# Altium schematic sheet STM32.SchDoc
size A3
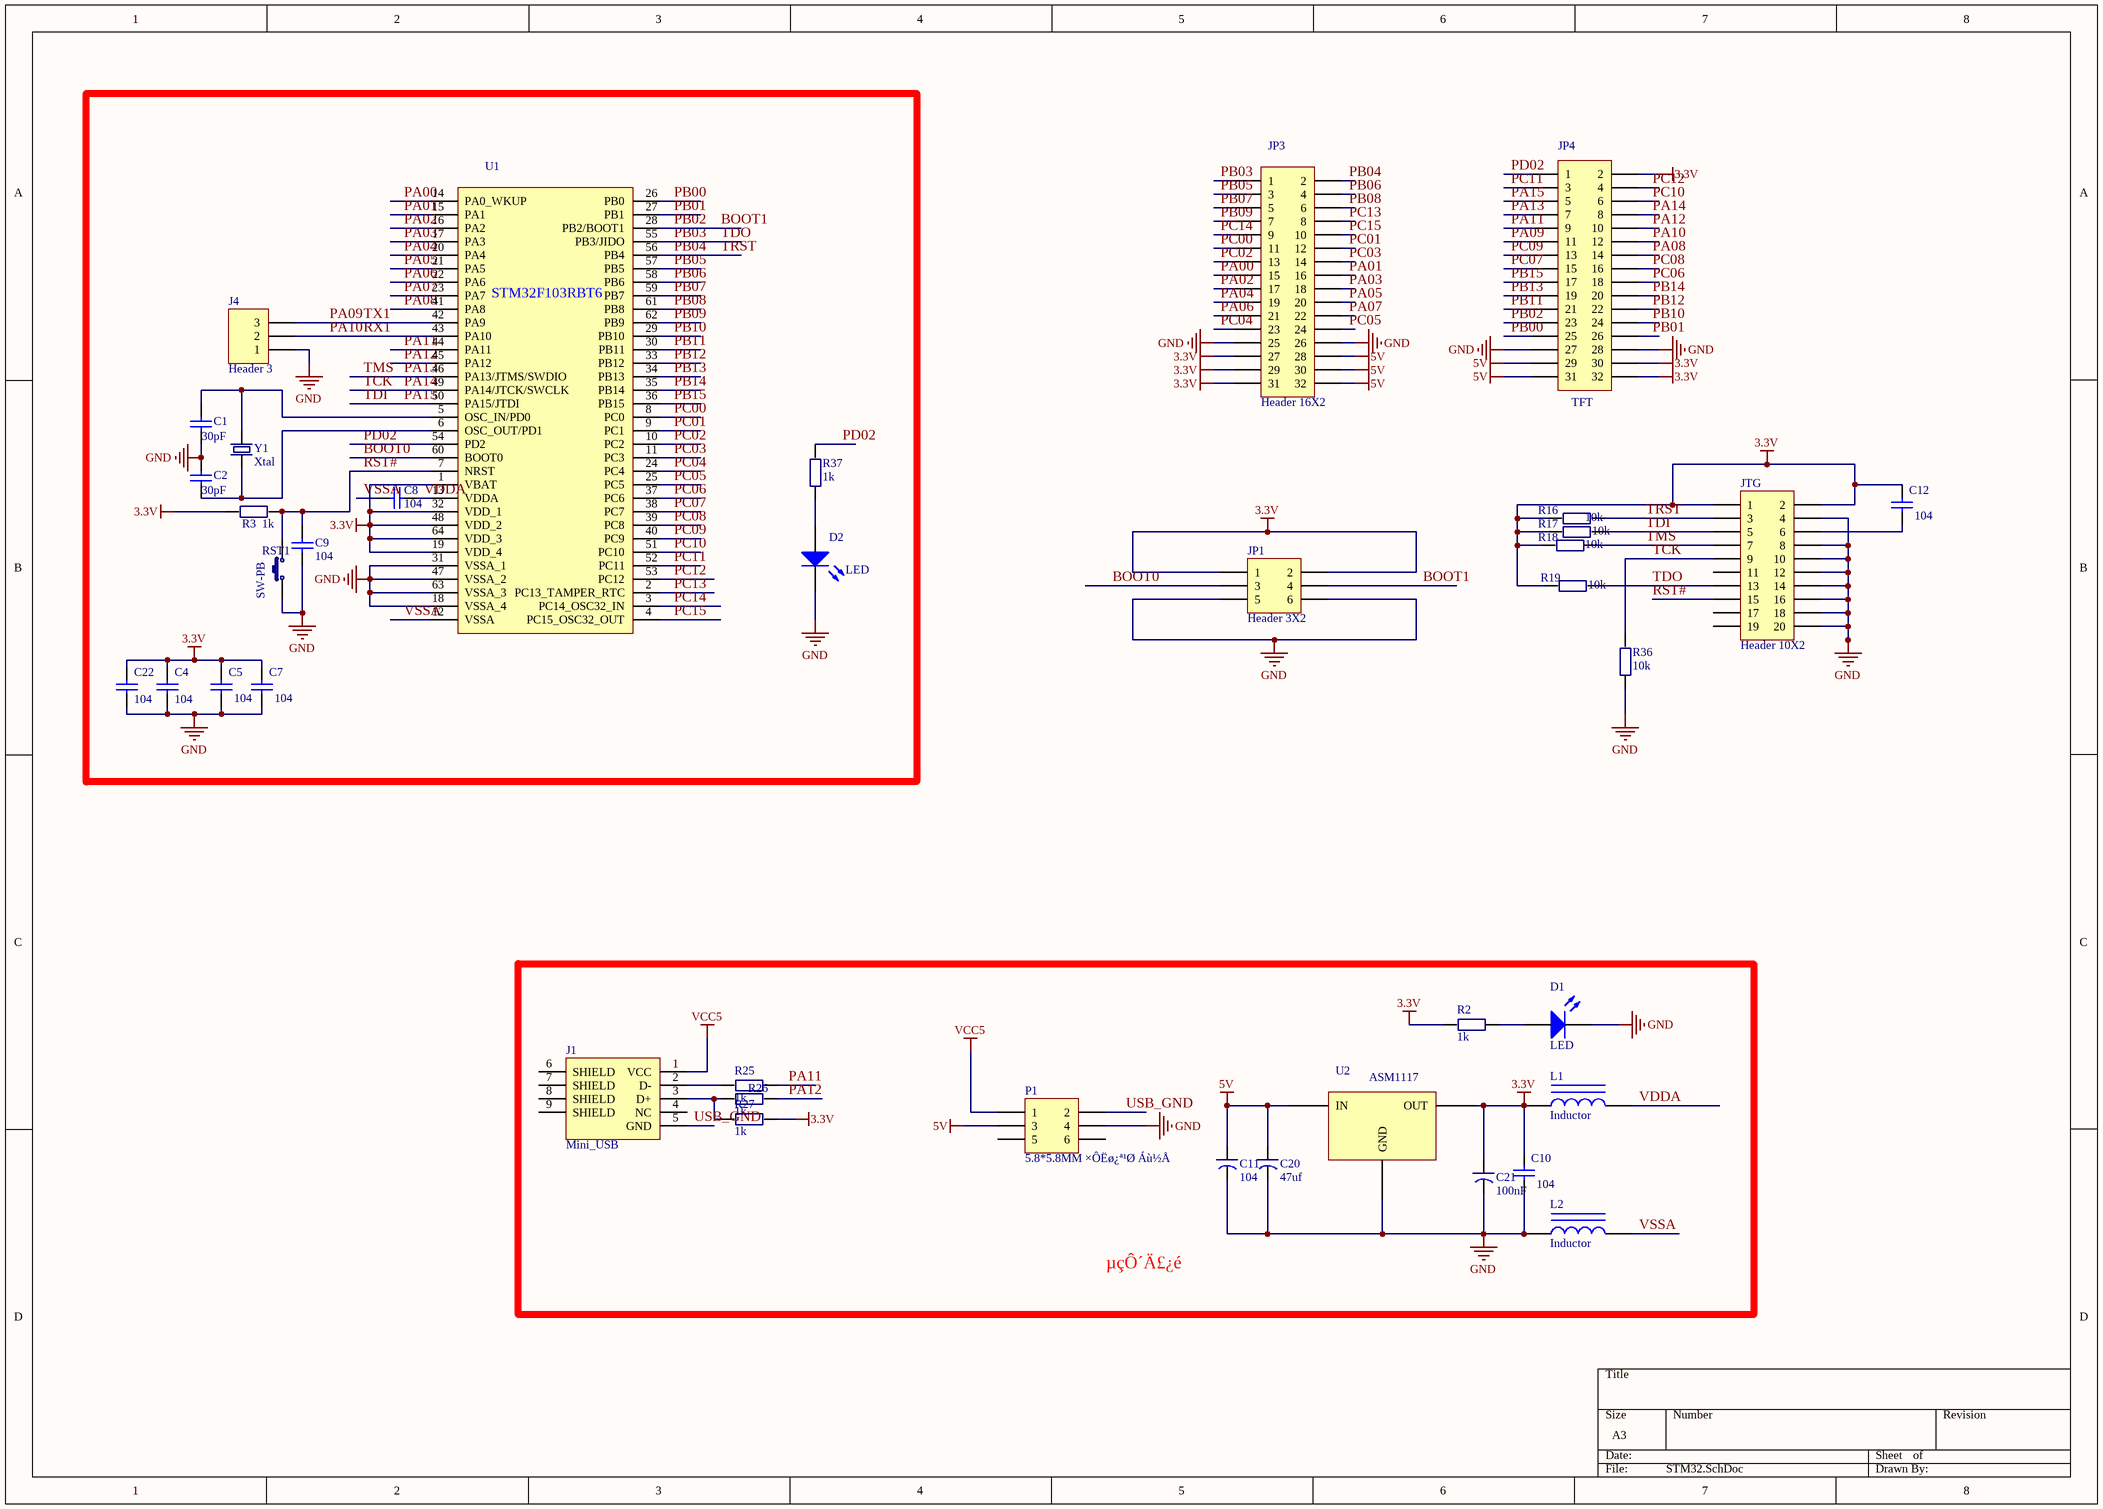
[diagram p0: STM32.SchDoc]

## Parts
C1  value 30pF  [C0805]  (hidden comment: Cap)
C2  value 30pF  [C0805]  (hidden comment: Cap)
C4  value 104  [C0805]  (hidden comment: Cap)
C5  value 104  [C0805]  (hidden comment: Cap)
C7  value 104  [C0805]  (hidden comment: Cap)
C8  value 104  [C0805]  (hidden comment: Cap)
C9  value 104  [C0805]  (hidden comment: Cap)
C10  value 104  [C0805]  (hidden comment: Cap)
C11  value 104  [C0805]  (hidden comment: Capacitor)
C12  value 104  [C0805]  (hidden comment: Cap)
C20  value 47uf  [47uF_25V]  (hidden comment: Capacitor)
C21  value 100nF  [47uF_25V]  (hidden comment: Capacitor)
C22  value 104  [C0805]  (hidden comment: Cap)
D1  LED  [0805D]
D2  LED  [0805D]
J1  Mini_USB  [Mini_USB]
J4  Header 3  [HDR1X3]
JP1  Header 3X2  [HDR2X3]
JP3  Header 16X2  [HDR2X16]
JP4  TFT  [HDR2X16]
JTG  Header 10X2  [HDR2X10]
L1  Inductor  [C0805]
L2  Inductor  [C0805]
P1  5.8*5.8MM ×ÔËø¿ª¹Ø Áù½Å  [5.8*5.8MM ×ÔËø¿ª¹Ø Áù½Å]
R2  value 1k  [R0805]  (hidden comment: Resistor)
R3  value 1k  [R0805]  (hidden comment: Resistor)
R16  value 10k  [R0805]  (hidden comment: Resistor)
R17  value 10k  [R0805]  (hidden comment: Resistor)
R18  value 10k  [R0805]  (hidden comment: Resistor)
R19  value 10k  [R0805]  (hidden comment: Resistor)
R25  value 1k  [R0805]  (hidden comment: Resistor)
R26  value 1k  [R0805]  (hidden comment: Resistor)
R27  value 1k  [R0805]  (hidden comment: Resistor)
R36  value 10k  [R0805]  (hidden comment: Resistor)
R37  value 1k  [R0805]  (hidden comment: Resistor)
RST1  SW-PB  [TD-19XA]
U1  STM32F103RBT6  [LQFP-64N]  (value not drawn)
U2  ASM1117  [SOT-223]
Y1  Xtal  [CRYSTAL]

## Blocks framed on the sheet
STM32F103RBT6: C1 C2 C4 C5 C7-C9 C22 D2 J4 R3 R37 RST1 U1 Y1
µçÔ´Ä£¿é: C10 C11 C20 C21 D1 J1 L1 L2 P1 R2 R25-R27 U2

## Nets
3.3V: C4.1 C5.1 C7.1 C10.1 C12.1 C21.1 C22.1 JP1.1 JP1.2 JP3.27 JP3.29 JP3.31 JP4.2 JP4.30 JP4.32 JTG.1 JTG.2 L1.1 R2.2 R3.1 R16.2 R17.2 R18.2 R19.2 R27.1 U1.1(VBAT) U1.19(VDD_4) U1.32(VDD_1) U1.48(VDD_2) U1.64(VDD_3) U2.2(OUT)
5V: C11.1 C20.1 JP3.28 JP3.30 JP3.32 JP4.29 JP4.31 P1.3 U2.3(IN)
GND: C1.1 C2.2 C4.2 C5.2 C7.2 C9.2 C10.2 C11.2 C20.2 C21.2 C22.2 D1.2(K) D2.2(K) J4.1 JP1.5 JP1.6 JP3.25 JP3.26 JP4.27 JP4.28 JTG.4 JTG.8 JTG.10 JTG.12 JTG.14 JTG.16 JTG.18 JTG.20 L2.1 P1.4 R36.2 RST1.1 U1.18(VSSA_4) U1.31(VSSA_1) U1.47(VSSA_2) U1.63(VSSA_3) U2.1(GND)
VCC5: J1.1(VCC) P1.1
BOOT0: JP1.3 U1.60(BOOT0)
BOOT1: JP1.4 JP4.23 U1.28(PB2/BOOT1)  [also labelled PB02]
PA00: JP3.15 U1.14(PA0_WKUP)
PA01: JP3.16 U1.15(PA1)
PA02: JP3.17 U1.16(PA2)
PA03: JP3.18 U1.17(PA3)
PA04: JP3.19 U1.20(PA4)
PA05: JP3.20 U1.21(PA5)
PA06: JP3.21 U1.22(PA6)
PA07: JP3.22 U1.23(PA7)
PA08: JP4.14 U1.41(PA8)
PA09: J4.3 JP4.11 U1.42(PA9)  [also labelled TX1]
PA10: J4.2 JP4.12 U1.43(PA10)  [also labelled RX1]
PA11: JP4.9 R25.1 U1.44(PA11)
PA12: JP4.10 R26.1 U1.45(PA12)
PA13: JP4.7 JTG.7 R18.1 U1.46(PA13/JTMS/SWDIO)  [also labelled TMS]
PA14: JP4.8 JTG.9 R36.1 U1.49(PA14/JTCK/SWCLK)  [also labelled TCK]
PA15: JP4.5 JTG.5 R17.1 U1.50(PA15/JTDI)  [also labelled TDI]
PB00: JP4.25 U1.26(PB0)
PB01: JP4.26 U1.27(PB1)
PB03: JP3.1 JTG.13 R19.1 U1.55(PB3/JIDO)  [also labelled TDO]
PB04: JP3.2 JTG.3 R16.1 U1.56(PB4)  [also labelled TRST]
PB05: JP3.3 U1.57(PB5)
PB06: JP3.4 U1.58(PB6)
PB07: JP3.5 U1.59(PB7)
PB08: JP3.6 U1.61(PB8)
PB09: JP3.7 U1.62(PB9)
PB10: JP4.24 U1.29(PB10)
PB11: JP4.21 U1.30(PB11)
PB12: JP4.22 U1.33(PB12)
PB13: JP4.19 U1.34(PB13)
PB14: JP4.20 U1.35(PB14)
PB15: JP4.17 U1.36(PB15)
PC00: JP3.11 U1.8(PC0)
PC01: JP3.12 U1.9(PC1)
PC02: JP3.13 U1.10(PC2)
PC03: JP3.14 U1.11(PC3)
PC04: JP3.23 U1.24(PC4)
PC05: JP3.24 U1.25(PC5)
PC06: JP4.18 U1.37(PC6)
PC07: JP4.15 U1.38(PC7)
PC08: JP4.16 U1.39(PC8)
PC09: JP4.13 U1.40(PC9)
PC10: JP4.6 U1.51(PC10)
PC11: JP4.3 U1.52(PC11)
PC12: JP4.4 U1.53(PC12)
PC13: JP3.8 U1.2(PC13_TAMPER_RTC)
PC14: JP3.9 U1.3(PC14_OSC32_IN)
PC15: JP3.10 U1.4(PC15_OSC32_OUT)
PD02: JP4.1 R37.2 U1.54(PD2)
RST#: C9.1 JTG.15 R3.2 RST1.2 U1.7(NRST)
USB_GND: J1.5(GND) P1.2
VDDA: C8.1 L1.2 U1.13(VDDA)
VSSA: C8.2 L2.2 U1.12(VSSA)
NetC1_2: C1.2 U1.5(OSC_IN/PD0) Y1.2
NetC2_1: C2.1 U1.6(OSC_OUT/PD1) Y1.1
NetC12_2: C12.2 JTG.6
NetD1_1: D1.1(A) R2.1
NetD2_1: D2.1(A) R37.1
NetJ1_2: J1.2(D-) R25.2
NetJ1_3: J1.3(D+) R26.2 R27.2

Not connected (* = marked no-connect by the designer): J1 4(NC) 6(SHIELD) 7(SHIELD) 8(SHIELD) 9(SHIELD); JTG 11 17 19; P1 5 6

## Library data of the parts
C1 C2 C4 C5 C7-C10 C12 C22 = Cap: Capacitor; Published: 8-Jun-2000; LatestRevisionDate: 17-Jul-2002; LatestRevisionNote: Re-released for DXP Platform.; PackageReference: RAD-0.3; Publisher: Altium Limited
J4 = Header 3: Header, 3-Pin; LatestRevisionDate: 17-Jul-2002; LatestRevisionNote: Re-released for DXP Platform.; Publisher: Altium Limited
JP1 = Header 3X2: Header, 3-Pin, Dual row; LatestRevisionDate: 17-Jul-2002; LatestRevisionNote: Re-released for DXP Platform.; Publisher: Altium Limited
JP3 JP4 = Header 16X2: Header, 16-Pin, Dual row; LatestRevisionDate: 17-Jul-2002; LatestRevisionNote: Re-released for DXP Platform.; Publisher: Altium Limited
JTG = Header 10X2: Header, 10-Pin, Dual row; LatestRevisionDate: 17-Jul-2002; LatestRevisionNote: Re-released for DXP Platform.; Publisher: Altium Limited
RST1 = Switch: value: *
Y1 = Xtal: value: *